# EAGLE schematic Spartan 6 Schematic (EAGLE 6.5.0)
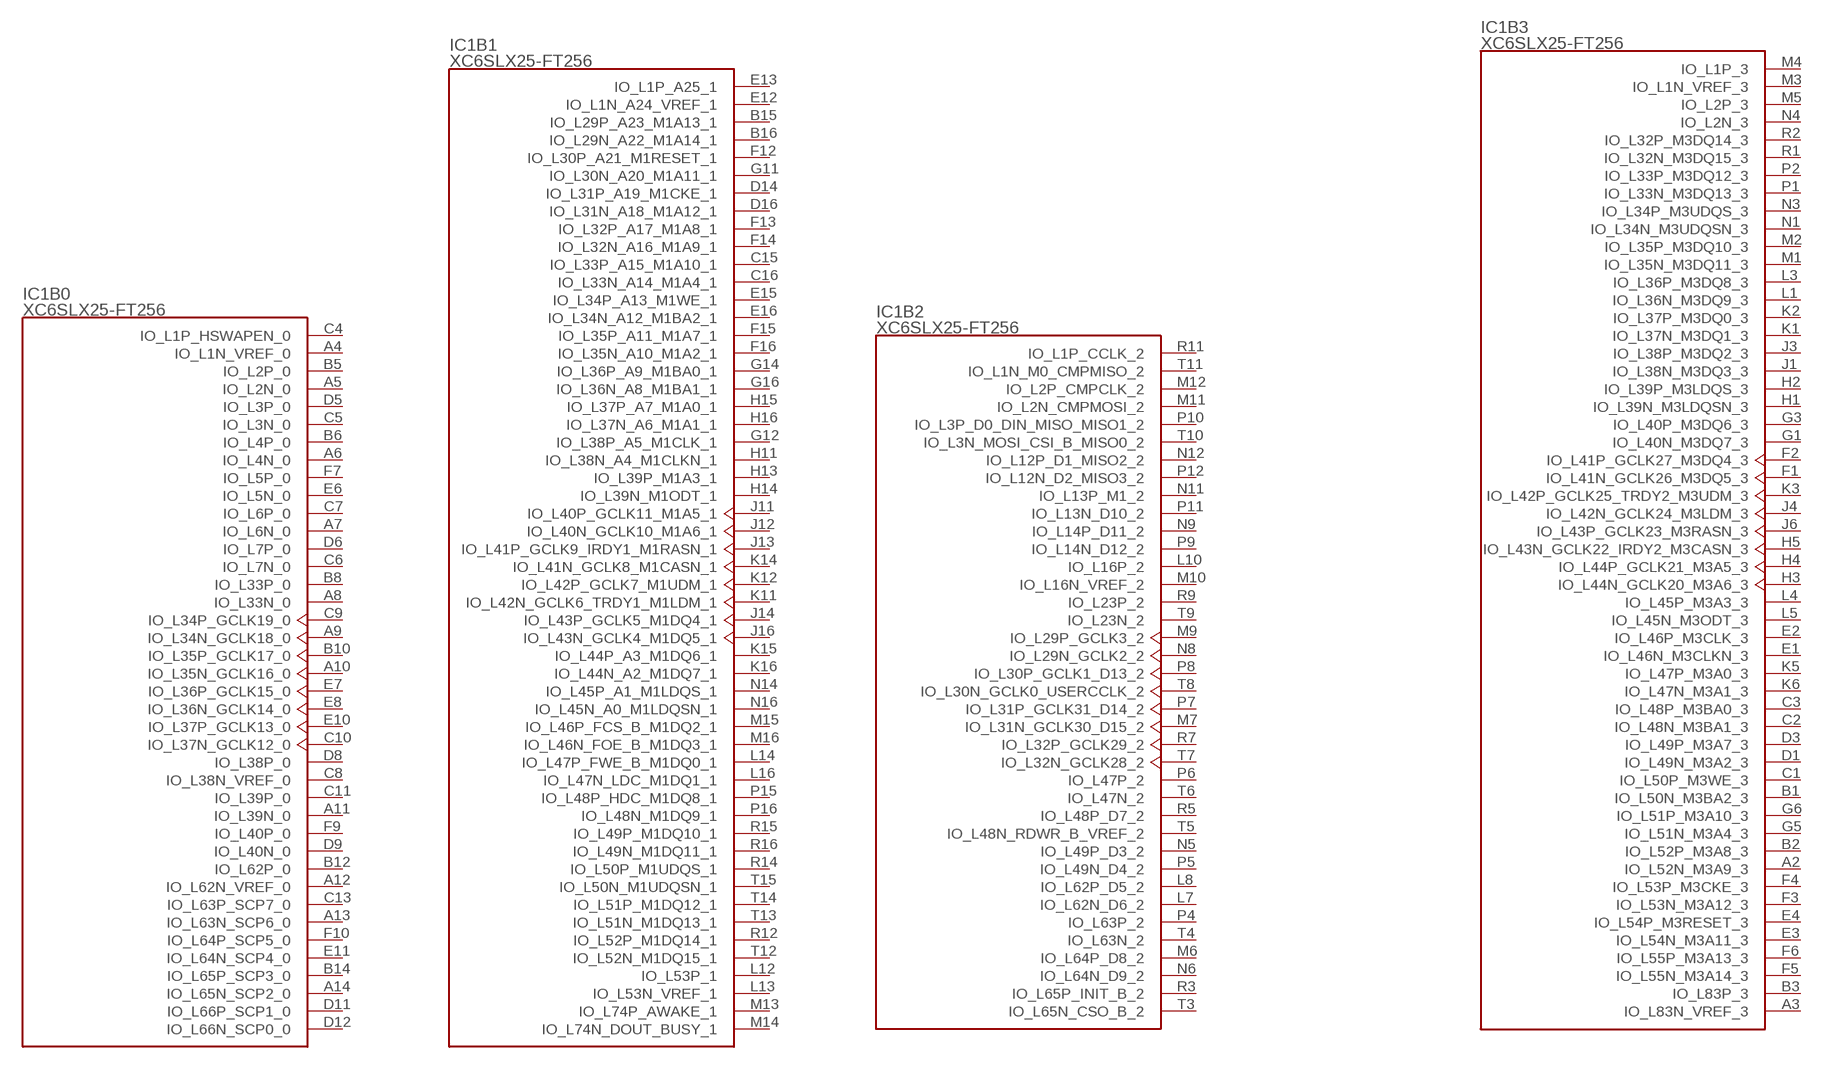
[diagram p0: schematic, sheet 1, part 1 of 2]
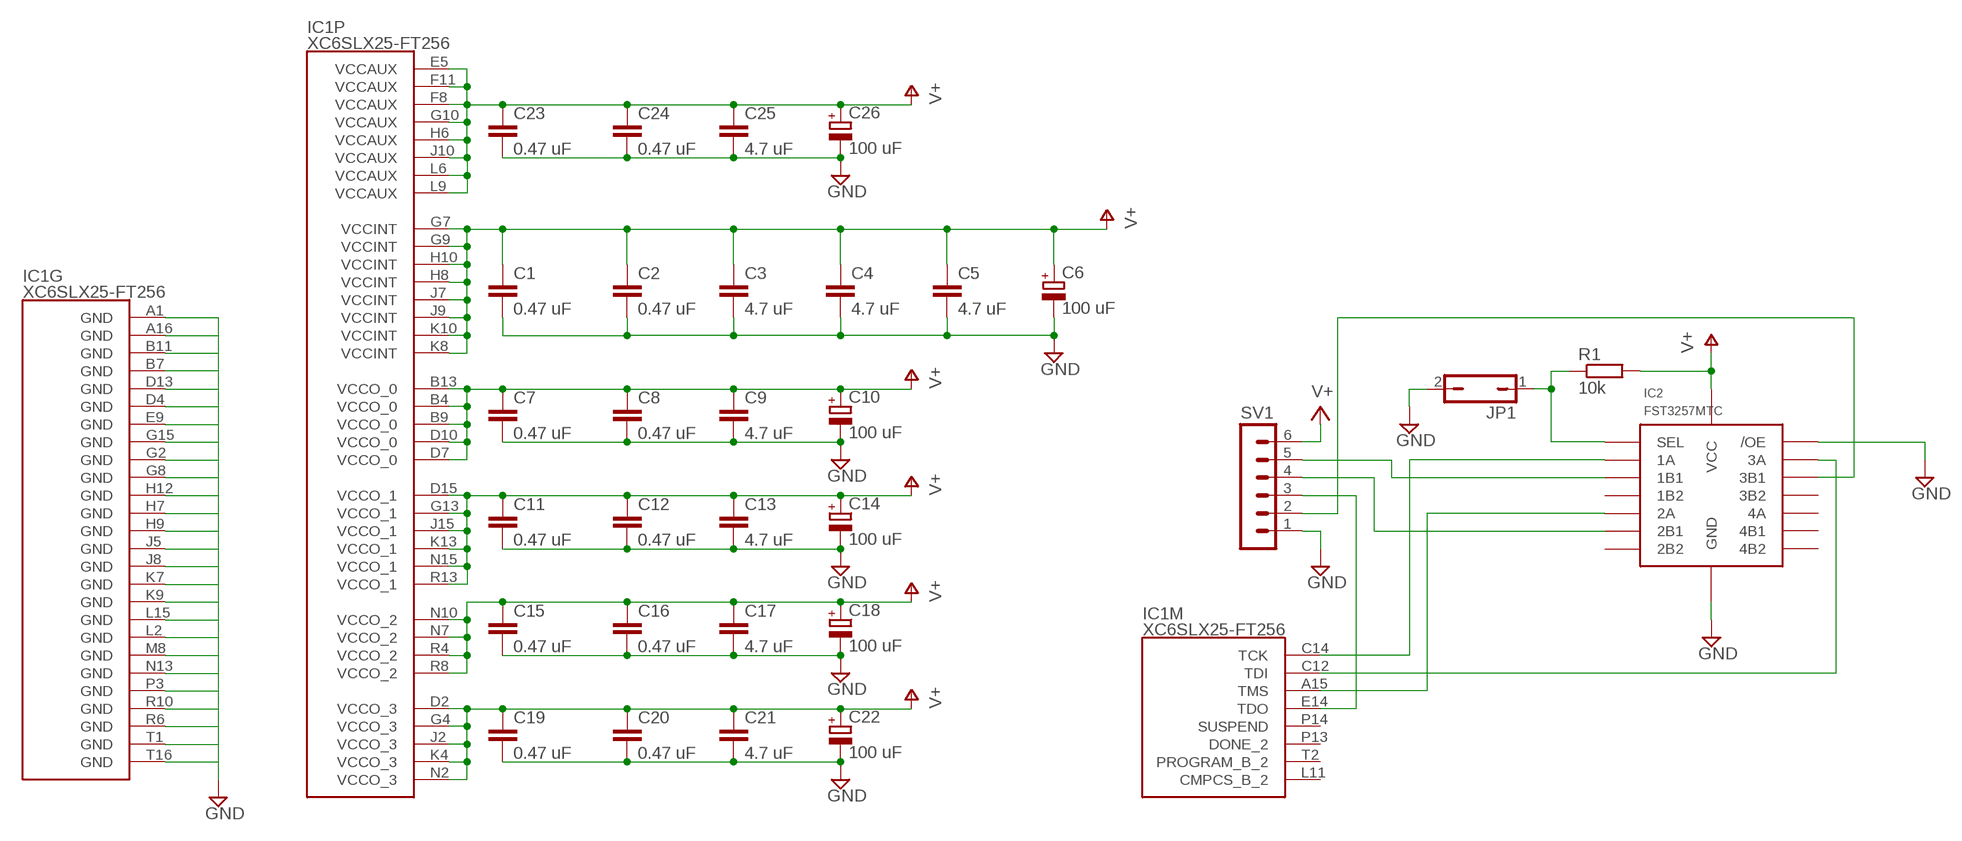
[diagram p1: schematic, sheet 1, part 2 of 2]

## Parts
C1  0.47 uF  C-EUC0402  [C0402]
C2  0.47 uF  C-EUC0402  [C0402]
C3  4.7 uF  C-EUC0805  [C0805]
C4  4.7 uF  C-EUC0805  [C0805]
C5  4.7 uF  C-EUC0805  [C0805]
C6  100 uF  CPOL-EUE5-10.5  [E5-10,5]
C7  0.47 uF  C-EUC0402  [C0402]
C8  0.47 uF  C-EUC0402  [C0402]
C9  4.7 uF  C-EUC0805  [C0805]
C10  100 uF  CPOL-EUE5-10.5  [E5-10,5]
C11  0.47 uF  C-EUC0402  [C0402]
C12  0.47 uF  C-EUC0402  [C0402]
C13  4.7 uF  C-EUC0805  [C0805]
C14  100 uF  CPOL-EUE5-10.5  [E5-10,5]
C15  0.47 uF  C-EUC0402  [C0402]
C16  0.47 uF  C-EUC0402  [C0402]
C17  4.7 uF  C-EUC0805  [C0805]
C18  100 uF  CPOL-EUE5-10.5  [E5-10,5]
C19  0.47 uF  C-EUC0402  [C0402]
C20  0.47 uF  C-EUC0402  [C0402]
C21  4.7 uF  C-EUC0805  [C0805]
C22  100 uF  CPOL-EUE5-10.5  [E5-10,5]
C23  0.47 uF  C-EUC0402  [C0402]
C24  0.47 uF  C-EUC0402  [C0402]
C25  4.7 uF  C-EUC0805  [C0805]
C26  100 uF  CPOL-EUE5-10.5  [E5-10,5]
IC1  XC6SLX25-FT256  [FT256]
IC2  FST3257MTC  [FST3257MTC]
JP1  JP1Q  [JP1]
R1  10k  R-EU_R0805  [R0805]
SV1  MA06-1  [MA06-1]

## Nets
GND: C1.2 C2.2 C3.2 C4.2 C5.2 C6.- C7.2 C8.2 C9.2 C10.- C11.2 C12.2 C13.2 C14.- C15.2 C16.2 C17.2 C18.- C19.2 C20.2 C21.2 C22.- C23.2 C24.2 C25.2 C26.- IC1.A1(G:GND) IC1.A16(G:GND) IC1.B7(G:GND) IC1.B11(G:GND) IC1.D4(G:GND) IC1.D13(G:GND) IC1.E9(G:GND) IC1.G2(G:GND) IC1.G8(G:GND) IC1.G15(G:GND) IC1.H7(G:GND) IC1.H9(G:GND) IC1.H12(G:GND) IC1.J5(G:GND) IC1.J8(G:GND) IC1.K7(G:GND) IC1.K9(G:GND) IC1.L2(G:GND) IC1.L15(G:GND) IC1.M8(G:GND) IC1.N13(G:GND) IC1.P3(G:GND) IC1.R6(G:GND) IC1.R10(G:GND) IC1.T1(G:GND) IC1.T16(G:GND) IC2.GND IC2.OE(/OE) JP1.2 SV1.1
N$1: IC2.1B1 SV1.5
N$2: IC2.2B1 SV1.4
N$3: IC1.E14(M:TDO) SV1.3
N$4: IC2.3B1 SV1.2
N$5: IC1.C14(M:TCK) IC2.1A
N$6: IC1.A15(M:TMS) IC2.2A
N$7: IC1.C12(M:TDI) IC2.3A
N$8: IC2.SEL JP1.1 R1.1
VCCAUX: C23.1 C24.1 C25.1 C26.+ IC1.L6(P:VCCAUX) IC1.L9(P:VCCAUX) SV1.6 ; supply symbol labelled V+
VCCINT: C1.1 C2.1 C3.1 C4.1 C5.1 C6.+ IC1.G7(P:VCCINT) IC1.G9(P:VCCINT) IC1.H8(P:VCCINT) IC1.H10(P:VCCINT) IC1.J7(P:VCCINT) IC1.J9(P:VCCINT) IC1.K8(P:VCCINT) IC1.K10(P:VCCINT) ; supply symbol labelled V+
VCCIO_0: C7.1 C8.1 C9.1 C10.+ ; supply symbol labelled V+
VCCIO_1: C11.1 C12.1 C13.1 C14.+ IC1.R13(P:VCCO_1) ; supply symbol labelled V+
VCCIO_2: C15.1 C16.1 C17.1 C18.+ IC2.VCC R1.2 ; supply symbol labelled V+
VCCIO_3: C19.1 C20.1 C21.1 C22.+ ; supply symbol labelled V+
Unconnected: IC1.A2(B3:IO_L52N_M3A9_3) IC1.A3(B3:IO_L83N_VREF_3) IC1.A4(B0:IO_L1N_VREF_0) IC1.A5(B0:IO_L2N_0) IC1.A6(B0:IO_L4N_0) IC1.A7(B0:IO_L6N_0) IC1.A8(B0:IO_L33N_0) IC1.A9(B0:IO_L34N_GCLK18_0) IC1.A10(B0:IO_L35N_GCLK16_0) IC1.A11(B0:IO_L39N_0) IC1.A12(B0:IO_L62N_VREF_0) IC1.A13(B0:IO_L63N_SCP6_0) IC1.A14(B0:IO_L65N_SCP2_0) IC1.B1(B3:IO_L50N_M3BA2_3) IC1.B2(B3:IO_L52P_M3A8_3) IC1.B3(B3:IO_L83P_3) IC1.B4(P:VCCO_0) IC1.B5(B0:IO_L2P_0) IC1.B6(B0:IO_L4P_0) IC1.B8(B0:IO_L33P_0) IC1.B9(P:VCCO_0) IC1.B10(B0:IO_L35P_GCLK17_0) IC1.B12(B0:IO_L62P_0) IC1.B13(P:VCCO_0) IC1.B14(B0:IO_L65P_SCP3_0) IC1.B15(B1:IO_L29P_A23_M1A13_1) IC1.B16(B1:IO_L29N_A22_M1A14_1) IC1.C1(B3:IO_L50P_M3WE_3) IC1.C2(B3:IO_L48N_M3BA1_3) IC1.C3(B3:IO_L48P_M3BA0_3) IC1.C4(B0:IO_L1P_HSWAPEN_0) IC1.C5(B0:IO_L3N_0) IC1.C6(B0:IO_L7N_0) IC1.C7(B0:IO_L6P_0) IC1.C8(B0:IO_L38N_VREF_0) IC1.C9(B0:IO_L34P_GCLK19_0) IC1.C10(B0:IO_L37N_GCLK12_0) IC1.C11(B0:IO_L39P_0) IC1.C13(B0:IO_L63P_SCP7_0) IC1.C15(B1:IO_L33P_A15_M1A10_1) IC1.C16(B1:IO_L33N_A14_M1A4_1) IC1.D1(B3:IO_L49N_M3A2_3) IC1.D2(P:VCCO_3) IC1.D3(B3:IO_L49P_M3A7_3) IC1.D5(B0:IO_L3P_0) IC1.D6(B0:IO_L7P_0) IC1.D7(P:VCCO_0) IC1.D8(B0:IO_L38P_0) IC1.D9(B0:IO_L40N_0) IC1.D10(P:VCCO_0) IC1.D11(B0:IO_L66P_SCP1_0) IC1.D12(B0:IO_L66N_SCP0_0) IC1.D14(B1:IO_L31P_A19_M1CKE_1) IC1.D15(P:VCCO_1) IC1.D16(B1:IO_L31N_A18_M1A12_1) IC1.E1(B3:IO_L46N_M3CLKN_3) IC1.E2(B3:IO_L46P_M3CLK_3) IC1.E3(B3:IO_L54N_M3A11_3) IC1.E4(B3:IO_L54P_M3RESET_3) IC1.E5(P:VCCAUX) IC1.E6(B0:IO_L5N_0) IC1.E7(B0:IO_L36P_GCLK15_0) IC1.E8(B0:IO_L36N_GCLK14_0) IC1.E10(B0:IO_L37P_GCLK13_0) IC1.E11(B0:IO_L64N_SCP4_0) IC1.E12(B1:IO_L1N_A24_VREF_1) IC1.E13(B1:IO_L1P_A25_1) IC1.E15(B1:IO_L34P_A13_M1WE_1) IC1.E16(B1:IO_L34N_A12_M1BA2_1) IC1.F1(B3:IO_L41N_GCLK26_M3DQ5_3) IC1.F2(B3:IO_L41P_GCLK27_M3DQ4_3) IC1.F3(B3:IO_L53N_M3A12_3) IC1.F4(B3:IO_L53P_M3CKE_3) IC1.F5(B3:IO_L55N_M3A14_3) IC1.F6(B3:IO_L55P_M3A13_3) IC1.F7(B0:IO_L5P_0) IC1.F8(P:VCCAUX) IC1.F9(B0:IO_L40P_0) IC1.F10(B0:IO_L64P_SCP5_0) IC1.F11(P:VCCAUX) IC1.F12(B1:IO_L30P_A21_M1RESET_1) IC1.F13(B1:IO_L32P_A17_M1A8_1) IC1.F14(B1:IO_L32N_A16_M1A9_1) IC1.F15(B1:IO_L35P_A11_M1A7_1) IC1.F16(B1:IO_L35N_A10_M1A2_1) IC1.G1(B3:IO_L40N_M3DQ7_3) IC1.G3(B3:IO_L40P_M3DQ6_3) IC1.G4(P:VCCO_3) IC1.G5(B3:IO_L51N_M3A4_3) IC1.G6(B3:IO_L51P_M3A10_3) IC1.G10(P:VCCAUX) IC1.G11(B1:IO_L30N_A20_M1A11_1) IC1.G12(B1:IO_L38P_A5_M1CLK_1) IC1.G13(P:VCCO_1) IC1.G14(B1:IO_L36P_A9_M1BA0_1) IC1.G16(B1:IO_L36N_A8_M1BA1_1) IC1.H1(B3:IO_L39N_M3LDQSN_3) IC1.H2(B3:IO_L39P_M3LDQS_3) IC1.H3(B3:IO_L44N_GCLK20_M3A6_3) IC1.H4(B3:IO_L44P_GCLK21_M3A5_3) IC1.H5(B3:IO_L43N_GCLK22_IRDY2_M3CASN_3) IC1.H6(P:VCCAUX) IC1.H11(B1:IO_L38N_A4_M1CLKN_1) IC1.H13(B1:IO_L39P_M1A3_1) IC1.H14(B1:IO_L39N_M1ODT_1) IC1.H15(B1:IO_L37P_A7_M1A0_1) IC1.H16(B1:IO_L37N_A6_M1A1_1) IC1.J1(B3:IO_L38N_M3DQ3_3) IC1.J2(P:VCCO_3) IC1.J3(B3:IO_L38P_M3DQ2_3) IC1.J4(B3:IO_L42N_GCLK24_M3LDM_3) IC1.J6(B3:IO_L43P_GCLK23_M3RASN_3) IC1.J10(P:VCCAUX) IC1.J11(B1:IO_L40P_GCLK11_M1A5_1) IC1.J12(B1:IO_L40N_GCLK10_M1A6_1) IC1.J13(B1:IO_L41P_GCLK9_IRDY1_M1RASN_1) IC1.J14(B1:IO_L43P_GCLK5_M1DQ4_1) IC1.J15(P:VCCO_1) IC1.J16(B1:IO_L43N_GCLK4_M1DQ5_1) IC1.K1(B3:IO_L37N_M3DQ1_3) IC1.K2(B3:IO_L37P_M3DQ0_3) IC1.K3(B3:IO_L42P_GCLK25_TRDY2_M3UDM_3) IC1.K4(P:VCCO_3) IC1.K5(B3:IO_L47P_M3A0_3) IC1.K6(B3:IO_L47N_M3A1_3) IC1.K11(B1:IO_L42N_GCLK6_TRDY1_M1LDM_1) IC1.K12(B1:IO_L42P_GCLK7_M1UDM_1) IC1.K13(P:VCCO_1) IC1.K14(B1:IO_L41N_GCLK8_M1CASN_1) IC1.K15(B1:IO_L44P_A3_M1DQ6_1) IC1.K16(B1:IO_L44N_A2_M1DQ7_1) IC1.L1(B3:IO_L36N_M3DQ9_3) IC1.L3(B3:IO_L36P_M3DQ8_3) IC1.L4(B3:IO_L45P_M3A3_3) IC1.L5(B3:IO_L45N_M3ODT_3) IC1.L7(B2:IO_L62N_D6_2) IC1.L8(B2:IO_L62P_D5_2) IC1.L10(B2:IO_L16P_2) IC1.L11(M:CMPCS_B_2) IC1.L12(B1:IO_L53P_1) IC1.L13(B1:IO_L53N_VREF_1) IC1.L14(B1:IO_L47P_FWE_B_M1DQ0_1) IC1.L16(B1:IO_L47N_LDC_M1DQ1_1) IC1.M1(B3:IO_L35N_M3DQ11_3) IC1.M2(B3:IO_L35P_M3DQ10_3) IC1.M3(B3:IO_L1N_VREF_3) IC1.M4(B3:IO_L1P_3) IC1.M5(B3:IO_L2P_3) IC1.M6(B2:IO_L64P_D8_2) IC1.M7(B2:IO_L31N_GCLK30_D15_2) IC1.M9(B2:IO_L29P_GCLK3_2) IC1.M10(B2:IO_L16N_VREF_2) IC1.M11(B2:IO_L2N_CMPMOSI_2) IC1.M12(B2:IO_L2P_CMPCLK_2) IC1.M13(B1:IO_L74P_AWAKE_1) IC1.M14(B1:IO_L74N_DOUT_BUSY_1) IC1.M15(B1:IO_L46P_FCS_B_M1DQ2_1) IC1.M16(B1:IO_L46N_FOE_B_M1DQ3_1) IC1.N1(B3:IO_L34N_M3UDQSN_3) IC1.N2(P:VCCO_3) IC1.N3(B3:IO_L34P_M3UDQS_3) IC1.N4(B3:IO_L2N_3) IC1.N5(B2:IO_L49P_D3_2) IC1.N6(B2:IO_L64N_D9_2) IC1.N7(P:VCCO_2) IC1.N8(B2:IO_L29N_GCLK2_2) IC1.N9(B2:IO_L14P_D11_2) IC1.N10(P:VCCO_2) IC1.N11(B2:IO_L13P_M1_2) IC1.N12(B2:IO_L12P_D1_MISO2_2) IC1.N14(B1:IO_L45P_A1_M1LDQS_1) IC1.N15(P:VCCO_1) IC1.N16(B1:IO_L45N_A0_M1LDQSN_1) IC1.P1(B3:IO_L33N_M3DQ13_3) IC1.P2(B3:IO_L33P_M3DQ12_3) IC1.P4(B2:IO_L63P_2) IC1.P5(B2:IO_L49N_D4_2) IC1.P6(B2:IO_L47P_2) IC1.P7(B2:IO_L31P_GCLK31_D14_2) IC1.P8(B2:IO_L30P_GCLK1_D13_2) IC1.P9(B2:IO_L14N_D12_2) IC1.P10(B2:IO_L3P_D0_DIN_MISO_MISO1_2) IC1.P11(B2:IO_L13N_D10_2) IC1.P12(B2:IO_L12N_D2_MISO3_2) IC1.P13(M:DONE_2) IC1.P14(M:SUSPEND) IC1.P15(B1:IO_L48P_HDC_M1DQ8_1) IC1.P16(B1:IO_L48N_M1DQ9_1) IC1.R1(B3:IO_L32N_M3DQ15_3) IC1.R2(B3:IO_L32P_M3DQ14_3) IC1.R3(B2:IO_L65P_INIT_B_2) IC1.R4(P:VCCO_2) IC1.R5(B2:IO_L48P_D7_2) IC1.R7(B2:IO_L32P_GCLK29_2) IC1.R8(P:VCCO_2) IC1.R9(B2:IO_L23P_2) IC1.R11(B2:IO_L1P_CCLK_2) IC1.R12(B1:IO_L52P_M1DQ14_1) IC1.R14(B1:IO_L50P_M1UDQS_1) IC1.R15(B1:IO_L49P_M1DQ10_1) IC1.R16(B1:IO_L49N_M1DQ11_1) IC1.T2(M:PROGRAM_B_2) IC1.T3(B2:IO_L65N_CSO_B_2) IC1.T4(B2:IO_L63N_2) IC1.T5(B2:IO_L48N_RDWR_B_VREF_2) IC1.T6(B2:IO_L47N_2) IC1.T7(B2:IO_L32N_GCLK28_2) IC1.T8(B2:IO_L30N_GCLK0_USERCCLK_2) IC1.T9(B2:IO_L23N_2) IC1.T10(B2:IO_L3N_MOSI_CSI_B_MISO0_2) IC1.T11(B2:IO_L1N_M0_CMPMISO_2) IC1.T12(B1:IO_L52N_M1DQ15_1) IC1.T13(B1:IO_L51N_M1DQ13_1) IC1.T14(B1:IO_L51P_M1DQ12_1) IC1.T15(B1:IO_L50N_M1UDQSN_1) IC2.1B2 IC2.2B2 IC2.3B2 IC2.4A IC2.4B1 IC2.4B2

## Library data of the parts
C1-C5 C7-C9 C11-C13 C15-C17 C19-C21 C23-C25 = rcl:C-EU: CAPACITOR, European symbol
C6 C10 C14 C18 C22 C26 = resistor:CPOL-EU: POLARIZED CAPACITOR, European symbol
IC1 = dan-xilinx:XC6SLX25-FT256: Xilinx Spartan-6 LX25 in FT256 package
IC2 = fairchild_FST3257:FST3257MTC: 4x2:1 MUX by Fairchild Semiconductor
JP1 = jumper:JP1Q: JUMPER
R1 = resistor:R-EU_: RESISTOR, European symbol
SV1 = con-lstb:MA06-1: PIN HEADER; OC_FARNELL: unknown; OC_NEWARK: unknown